# Altium schematic sheet DTImp.SchDoc
size A4
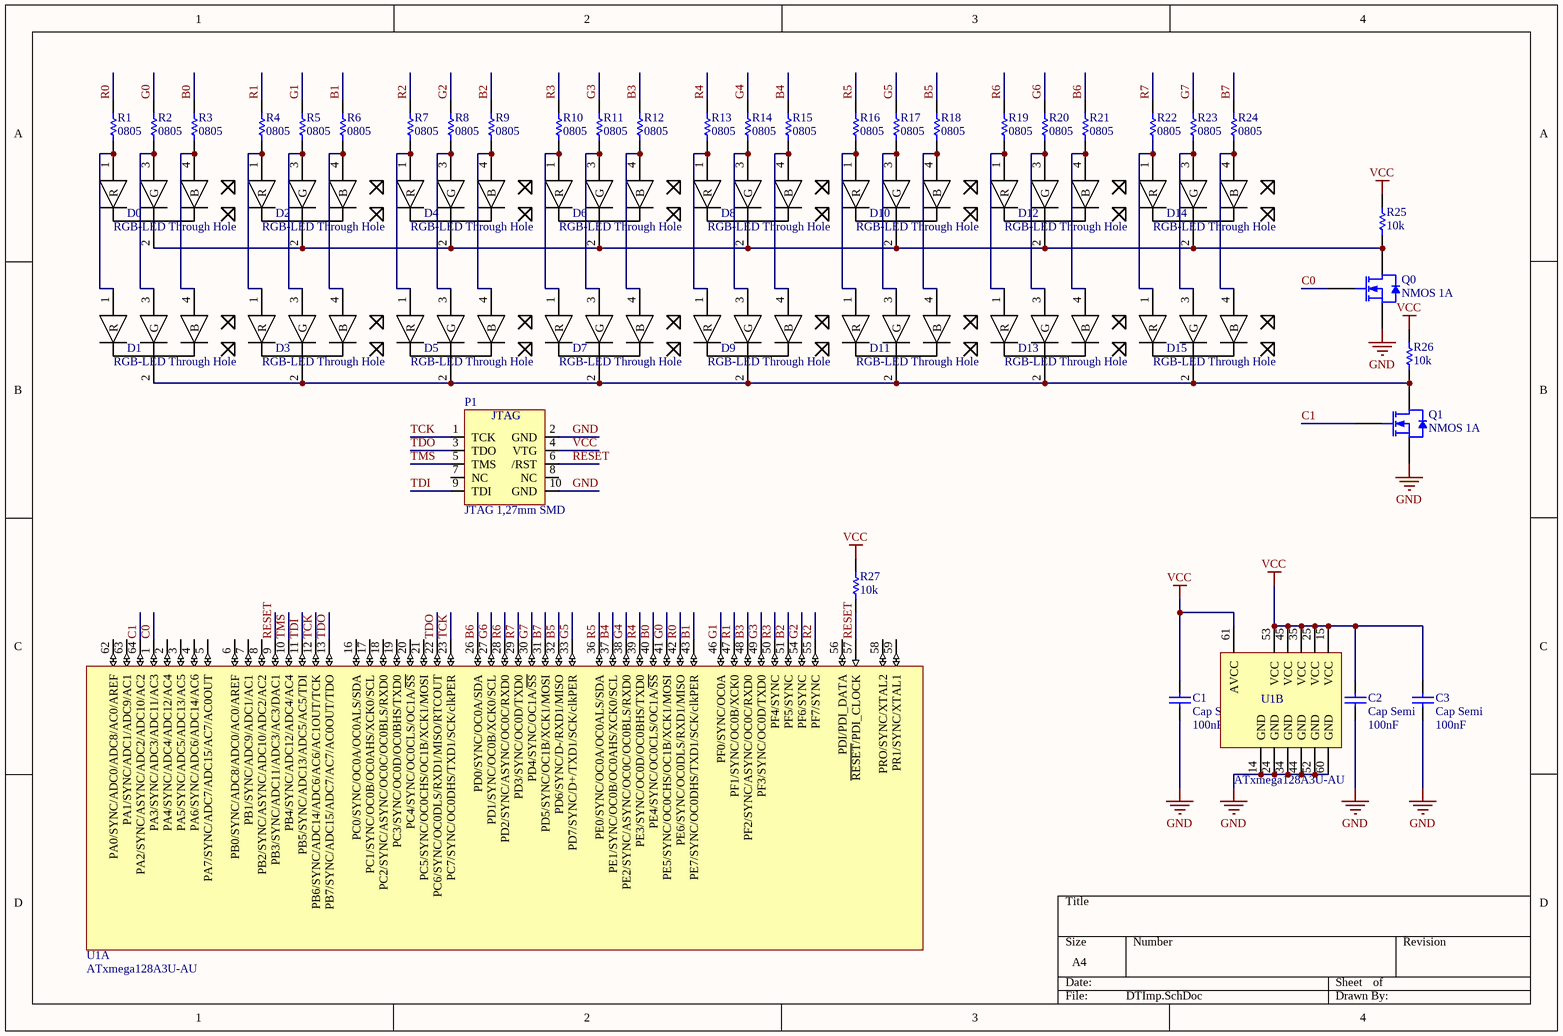
[diagram p0: DTImp.SchDoc]

## Parts
C1  Cap Semi  value 100nF  [C1206]
C2  Cap Semi  value 100nF  [C1206]
C3  Cap Semi  value 100nF  [C1206]
D0  RGB-LED Through Hole  [RGB-LED Through Hole]
D1  RGB-LED Through Hole  [RGB-LED Through Hole]
D2  RGB-LED Through Hole  [RGB-LED Through Hole]
D3  RGB-LED Through Hole  [RGB-LED Through Hole]
D4  RGB-LED Through Hole  [RGB-LED Through Hole]
D5  RGB-LED Through Hole  [RGB-LED Through Hole]
D6  RGB-LED Through Hole  [RGB-LED Through Hole]
D7  RGB-LED Through Hole  [RGB-LED Through Hole]
D8  RGB-LED Through Hole  [RGB-LED Through Hole]
D9  RGB-LED Through Hole  [RGB-LED Through Hole]
D10  RGB-LED Through Hole  [RGB-LED Through Hole]
D11  RGB-LED Through Hole  [RGB-LED Through Hole]
D12  RGB-LED Through Hole  [RGB-LED Through Hole]
D13  RGB-LED Through Hole  [RGB-LED Through Hole]
D14  RGB-LED Through Hole  [RGB-LED Through Hole]
D15  RGB-LED Through Hole  [RGB-LED Through Hole]
P1  JTAG 1,27mm SMD  [Header 1,27mm SMD 10P]
Q0  NMOS 1A  [SOT23_N]
Q1  NMOS 1A  [SOT23_N]
R1  0805  [ERA-0805]
R2  0805  [ERA-0805]
R3  0805  [ERA-0805]
R4  0805  [ERA-0805]
R5  0805  [ERA-0805]
R6  0805  [ERA-0805]
R7  0805  [ERA-0805]
R8  0805  [ERA-0805]
R9  0805  [ERA-0805]
R10  0805  [ERA-0805]
R11  0805  [ERA-0805]
R12  0805  [ERA-0805]
R13  0805  [ERA-0805]
R14  0805  [ERA-0805]
R15  0805  [ERA-0805]
R16  0805  [ERA-0805]
R17  0805  [ERA-0805]
R18  0805  [ERA-0805]
R19  0805  [ERA-0805]
R20  0805  [ERA-0805]
R21  0805  [ERA-0805]
R22  0805  [ERA-0805]
R23  0805  [ERA-0805]
R24  0805  [ERA-0805]
R25  10k  [ERA-0805]
R26  10k  [ERA-0805]
R27  10k  [ERA-0805]
U1  ATxmega128A3U-AU  [64A_N]  (parts A,B of 2)

## Nets
GND: C1.1 C2.1 C3.1 P1.2(GND) P1.10(GND) Q0.2(S) Q1.2(S) U1.14(GND) U1.24(GND) U1.34(GND) U1.44(GND) U1.52(GND) U1.60(GND)
VCC: C1.2 C2.2 C3.2 P1.4(VTG) R25.2 R26.2 R27.1 U1.15(VCC) U1.25(VCC) U1.35(VCC) U1.45(VCC) U1.53(VCC) U1.61(AVCC)
B0: R3.2 U1.40(PE4/SYNC/OC0CLS/OC1A/~{SS})
B1: R6.2 U1.43(PE7/SYNC/OC0DHS/TXD1/SCK/clkPER)
B2: R9.2 U1.51(PF5/SYNC)
B3: R12.2 U1.48(PF2/SYNC/ASYNC/OC0C/RXD0)
B4: R15.2 U1.37(PE1/SYNC/OC0B/OC0AHS/XCK0/SCL)
B5: R18.2 U1.32(PD6/SYNC/D-/RXD1/MISO)
B6: R21.2 U1.26(PD0/SYNC/OC0A/SDA)
B7: R24.2 U1.31(PD5/SYNC/OC1B/XCK1/MOSI)
C0: Q0.1(G) U1.1(PA3/SYNC/ADC3/ADC11/AC3)
C1: Q1.1(G) U1.64(PA2/SYNC/ASYNC/ADC2/ADC10/AC2)
G0: R2.2 U1.41(PE5/SYNC/OC0CHS/OC1B/XCK1/MOSI)
G1: R5.2 U1.46(PF0/SYNC/OC0A)
G2: R8.2 U1.54(PF6/SYNC)
G3: R11.2 U1.49(PF3/SYNC/OC0D/TXD0)
G4: R14.2 U1.38(PE2/SYNC/ASYNC/OC0C/OC0BLS/RXD0)
G5: R17.2 U1.33(PD7/SYNC/D+/TXD1/SCK/clkPER)
G6: R20.2 U1.27(PD1/SYNC/OC0B/XCK0/SCL)
G7: R23.2 U1.30(PD4/SYNC/OC1A/~{SS})
R0: R1.2 U1.42(PE6/SYNC/OC0DLS/RXD1/MISO)
R1: R4.2 U1.47(PF1/SYNC/OC0B/XCK0)
R2: R7.2 U1.55(PF7/SYNC)
R3: R10.2 U1.50(PF4/SYNC)
R4: R13.2 U1.39(PE3/SYNC/OC0D/OC0BHS/TXD0)
R5: R16.2 U1.36(PE0/SYNC/OC0A/OC0ALS/SDA)
R6: R19.2 U1.28(PD2/SYNC/ASYNC/OC0C/RXD0)
R7: R22.2 U1.29(PD3/SYNC/OC0D/TXD0)
RESET: P1.6(/RST) R27.2 U1.9(PB3/SYNC/ADC11/ADC3/AC3/DAC1) U1.57(~{RESET}/PDI_CLOCK)
TCK: P1.1(TCK) U1.12(PB6/SYNC/ADC14/ADC6/AC6/AC1OUT/TCK) U1.23(PC7/SYNC/OC0DHS/TXD1/SCK/clkPER)
TDI: P1.9(TDI) U1.11(PB5/SYNC/ADC13/ADC5/AC5/TDI)
TDO: P1.3(TDO) U1.13(PB7/SYNC/ADC15/ADC7/AC7/AC0OUT/TDO) U1.22(PC6/SYNC/OC0DLS/RXD1/MISO/RTCOUT)
TMS: P1.5(TMS) U1.10(PB4/SYNC/ADC12/ADC4/AC4)
NetD0_1: D0.1(R) D1.1(R) R1.1
NetD0_2: D0.2(C) D2.2(C) D4.2(C) D6.2(C) D8.2(C) D10.2(C) D12.2(C) D14.2(C) Q0.3(D) R25.1
NetD0_3: D0.3(G) D1.3(G) R2.1
NetD0_4: D0.4(B) D1.4(B) R3.1
NetD1_2: D1.2(C) D3.2(C) D5.2(C) D7.2(C) D9.2(C) D11.2(C) D13.2(C) D15.2(C) Q1.3(D) R26.1
NetD2_1: D2.1(R) D3.1(R) R4.1
NetD2_3: D2.3(G) D3.3(G) R5.1
NetD2_4: D2.4(B) D3.4(B) R6.1
NetD4_1: D4.1(R) D5.1(R) R7.1
NetD4_3: D4.3(G) D5.3(G) R8.1
NetD4_4: D4.4(B) D5.4(B) R9.1
NetD6_1: D6.1(R) D7.1(R) R10.1
NetD6_3: D6.3(G) D7.3(G) R11.1
NetD6_4: D6.4(B) D7.4(B) R12.1
NetD8_1: D8.1(R) D9.1(R) R13.1
NetD8_3: D8.3(G) D9.3(G) R14.1
NetD8_4: D8.4(B) D9.4(B) R15.1
NetD10_1: D10.1(R) D11.1(R) R16.1
NetD10_3: D10.3(G) D11.3(G) R17.1
NetD10_4: D10.4(B) D11.4(B) R18.1
NetD12_1: D12.1(R) D13.1(R) R19.1
NetD12_3: D12.3(G) D13.3(G) R20.1
NetD12_4: D12.4(B) D13.4(B) R21.1
NetD14_1: D14.1(R) D15.1(R) R22.1
NetD14_3: D14.3(G) D15.3(G) R23.1
NetD14_4: D14.4(B) D15.4(B) R24.1

Not connected (* = marked no-connect by the designer): P1 7(NC) 8(NC); U1 2(PA4/SYNC/ADC4/ADC12/AC4) 3(PA5/SYNC/ADC5/ADC13/AC5) 4(PA6/SYNC/ADC6/ADC14/AC6) 5(PA7/SYNC/ADC7/ADC15/AC7/AC0OUT) 6(PB0/SYNC/ADC8/ADC0/AC0/AREF) 7(PB1/SYNC/ADC9/ADC1/AC1) 8(PB2/SYNC/ASYNC/ADC10/ADC2/AC2) 16(PC0/SYNC/OC0A/OC0ALS/SDA) 17(PC1/SYNC/OC0B/OC0AHS/XCK0/SCL) 18(PC2/SYNC/ASYNC/OC0C/OC0BLS/RXD0) 19(PC3/SYNC/OC0D/OC0BHS/TXD0) 20(PC4/SYNC/OC0CLS/OC1A/~{SS}) 21(PC5/SYNC/OC0CHS/OC1B/XCK1/MOSI) 56(PDI/PDI_DATA) 58(PRO/SYNC/XTAL2) 59(PR1/SYNC/XTAL1) 62(PA0/SYNC/ADC0/ADC8/AC0/AREF) 63(PA1/SYNC/ADC1/ADC9/AC1)

## Notes on the sheet
- (in symbol JTAG 1,27mm SMD) JTAG

## Library data of the parts
C1-C3 = Cap Semi: Capacitor (Semiconductor SIM Model); Published: 8-Jun-2000; LatestRevisionDate: 29-May-2009; LatestRevisionNote: IPC-7351 Footprint Added.; PackageReference: C1206; Publisher: Altium Limited; PackageDescription: Chip Capacitor
Q0 Q1 = 2N7002: N-channel Enhancement Mode Field-effect Transistor; Published: 17-Sep-2003; LatestRevisionDate: 12-Dec-2006; LatestRevisionNote: IPC-7351 Footprint Added.; DatasheetVersion: 27-Jul-2000; PackageVersion: May-1999; PackageReference: SOT23; Publisher: Altium Limited; PackageDescription: 3-Pin SOT-23 Package 0.95 mm Pitch, 2.3 mm Lead Span; ComponentLink1Description: Manufacturer Link; ComponentLink1URL: http://www.semiconductors.philips.com/; ComponentLink2Description: Datasheet; ComponentLink2URL: http://www.semiconductors.philips.com/acrobat/datasheets/2N7002_4.pdf
R1 = ERA6Y: 0805 SMD; Note: If flow soldering, adjust pad width of PCB Footprint to 0.7 - 0.8 times the width of the resistor.; value: 68R; Value: 68R; Published: 17-Dec-2003; LatestRevisionDate: 19-Mar-2004; LatestRevisionNote: Silkscreen size reduced.; PackageDocument: Mar-2003; PackageReference: ERA-0805; Publisher: Altium Limited; Code_IPC: 2012 [0805]; ComponentLink1Description: Manufacturer Link; ComponentLink1URL: http://www.panasonic.com/industrial/components/resistive_products.htm; ComponentLink2Description: Datasheet
R2 R3 R5 R6 R8 R9 R11 R12 R14 R15 R17 R18 R20 R21 R23 R24 = ERA6Y: 0805 SMD; Note: If flow soldering, adjust pad width of PCB Footprint to 0.7 - 0.8 times the width of the resistor.; Value: 120R; Published: 17-Dec-2003; LatestRevisionDate: 19-Mar-2004; LatestRevisionNote: Silkscreen size reduced.; PackageDocument: Mar-2003; PackageReference: ERA-0805; Publisher: Altium Limited; Code_IPC: 2012 [0805]; ComponentLink1Description: Manufacturer Link; ComponentLink1URL: http://www.panasonic.com/industrial/components/resistive_products.htm; ComponentLink2Description: Datasheet; ComponentLink2URL: http://www.panasonic.com/industrial/components/pdf/AOA0000CE8.pdf
R4 R7 R10 = ERA6Y: 0805 SMD; Note: If flow soldering, adjust pad width of PCB Footprint to 0.7 - 0.8 times the width of the resistor.; Value: 68R; Value: 68R; Published: 17-Dec-2003; LatestRevisionDate: 19-Mar-2004; LatestRevisionNote: Silkscreen size reduced.; PackageDocument: Mar-2003; PackageReference: ERA-0805; Publisher: Altium Limited; Code_IPC: 2012 [0805]; ComponentLink1Description: Manufacturer Link; ComponentLink1URL: http://www.panasonic.com/industrial/components/resistive_products.htm; ComponentLink2Description: Datasheet
R13 R16 R19 R22 = ERA6Y: 0805 SMD; Note: If flow soldering, adjust pad width of PCB Footprint to 0.7 - 0.8 times the width of the resistor.; Value: 68R; Published: 17-Dec-2003; LatestRevisionDate: 19-Mar-2004; LatestRevisionNote: Silkscreen size reduced.; PackageDocument: Mar-2003; PackageReference: ERA-0805; Publisher: Altium Limited; Code_IPC: 2012 [0805]; ComponentLink1Description: Manufacturer Link; ComponentLink1URL: http://www.panasonic.com/industrial/components/resistive_products.htm; ComponentLink2Description: Datasheet
R25 R26 = ERA6Y: Rectangular Thick Film Chip Resistor, 10 Ohm to 1M Ohm Range, 0.1% and 0.5% Tolerance, 0805 Size, 0.1 W; Note: If flow soldering, adjust pad width of PCB Footprint to 0.7 - 0.8 times the width of the resistor.; Published: 17-Dec-2003; LatestRevisionDate: 19-Mar-2004; LatestRevisionNote: Silkscreen size reduced.; PackageDocument: Mar-2003; PackageReference: ERA-0805; Publisher: Altium Limited; Code_IPC: 2012 [0805]; ComponentLink1Description: Manufacturer Link; ComponentLink1URL: http://www.panasonic.com/industrial/components/resistive_products.htm; ComponentLink2Description: Datasheet; ComponentLink2URL: http://www.panasonic.com/industrial/components/pdf/AOA0000CE8.pdf; Value: 10k
R27 = ERA6Y: 10kOhm; Note: If flow soldering, adjust pad width of PCB Footprint to 0.7 - 0.8 times the width of the resistor.; Published: 17-Dec-2003; LatestRevisionDate: 19-Mar-2004; LatestRevisionNote: Silkscreen size reduced.; PackageDocument: Mar-2003; PackageReference: ERA-0805; Publisher: Altium Limited; Code_IPC: 2012 [0805]; ComponentLink1Description: Manufacturer Link; ComponentLink1URL: http://www.panasonic.com/industrial/components/resistive_products.htm; ComponentLink2Description: Datasheet; ComponentLink2URL: http://www.panasonic.com/industrial/components/pdf/AOA0000CE8.pdf; Value: 10k
U1 = ATxmega128A3U-AU: 8/16-bit AVR XMEGA A4 Microcontroller, 1.6-3.6V, 32MHz, 128K + 8KB Flash, 2K EEPROM, 8K SRAM, 64-pin TQFP, Industrial Grade (-40°C to 85°C); DatasheetVersion: revB, Dec-2011; PackageVersion: revC, Oct-2010; PackageReference: 64A; PackageDescription: 64-Pin Plastic Thin Profile Quad Flat Pack, 14 x 14 x 1.0 mm Body, 0.8 mm Pitch (TQFP); Code_JEDEC: MS-026-AEB; ComponentLink1Description: Manufacturer URL; ComponentLink1URL: http://www.atmel.com/; ComponentLink2Description: ATxmega64A3U/128A3U/192A3U/256A3U Datasheet; ComponentLink2URL: http://www.atmel.com/dyn/resources/prod_documents/doc8386.pdf